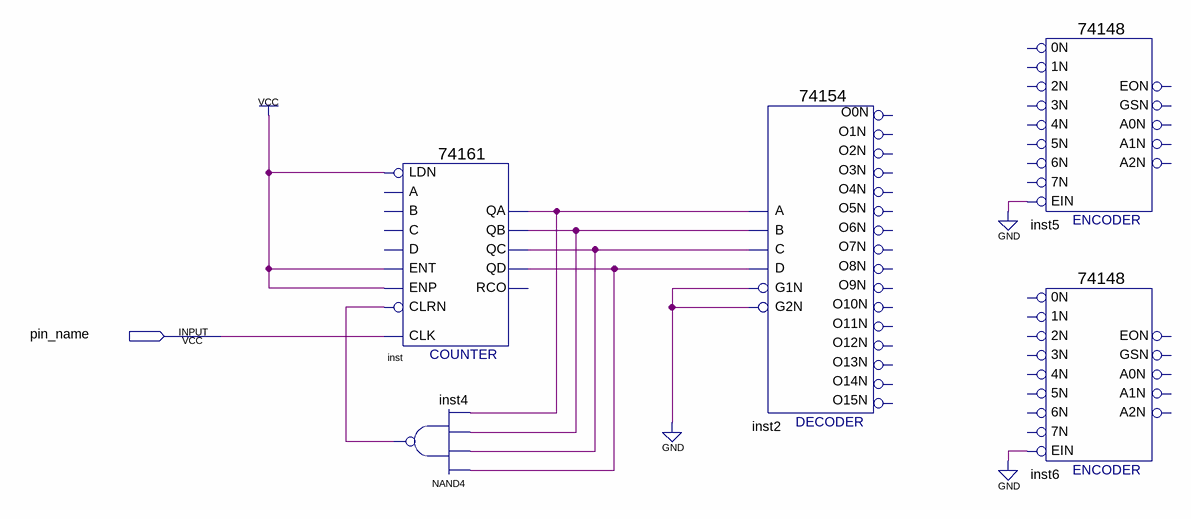
[diagram p0: schematic sheet]
// Quartus schematic Block1.bdf as structural Verilog: 5 symbols, 1 pins
module Block1 (
  input  pin_name
);

  wire inst4_out, inst_qa, inst_qb, inst_qc, inst_qd;

  \74161  inst (
    .CLRN(inst4_out), .CLK(pin_name), .ENP(1'b1), .LDN(1'b1), .ENT(1'b1), .QD(inst_qd), .QC(inst_qc),
    .QB(inst_qb), .QA(inst_qa));  // open: A, D, B, C, RCO
  nand inst4 (inst4_out, inst_qd, inst_qc, inst_qb, inst_qa);
  \74154  inst2 (
    .C(inst_qc), .D(inst_qd), .B(inst_qb), .A(inst_qa), .G1N(1'b0), .G2N(1'b0));  // open: O0N, O12N, O15N, O10N, O11N, O1N, O13N, O14N, O4N, O3N, O2N, O7N, O6N, O5N, O9N, O8N
  \74148  inst5 (.EIN(1'b0));  // open: 5N, 0N, 1N, 2N, 3N, 4N, 6N, 7N, A1N, A0N, A2N, EON, GSN
  \74148  inst6 (.EIN(1'b0));  // open: 5N, 0N, 1N, 2N, 3N, 4N, 6N, 7N, A1N, A0N, A2N, EON, GSN
endmodule
